# EAGLE design FRAM-DIP (EAGLE 9.6.2)
PC Engine Joypad Breakout Version 1.0
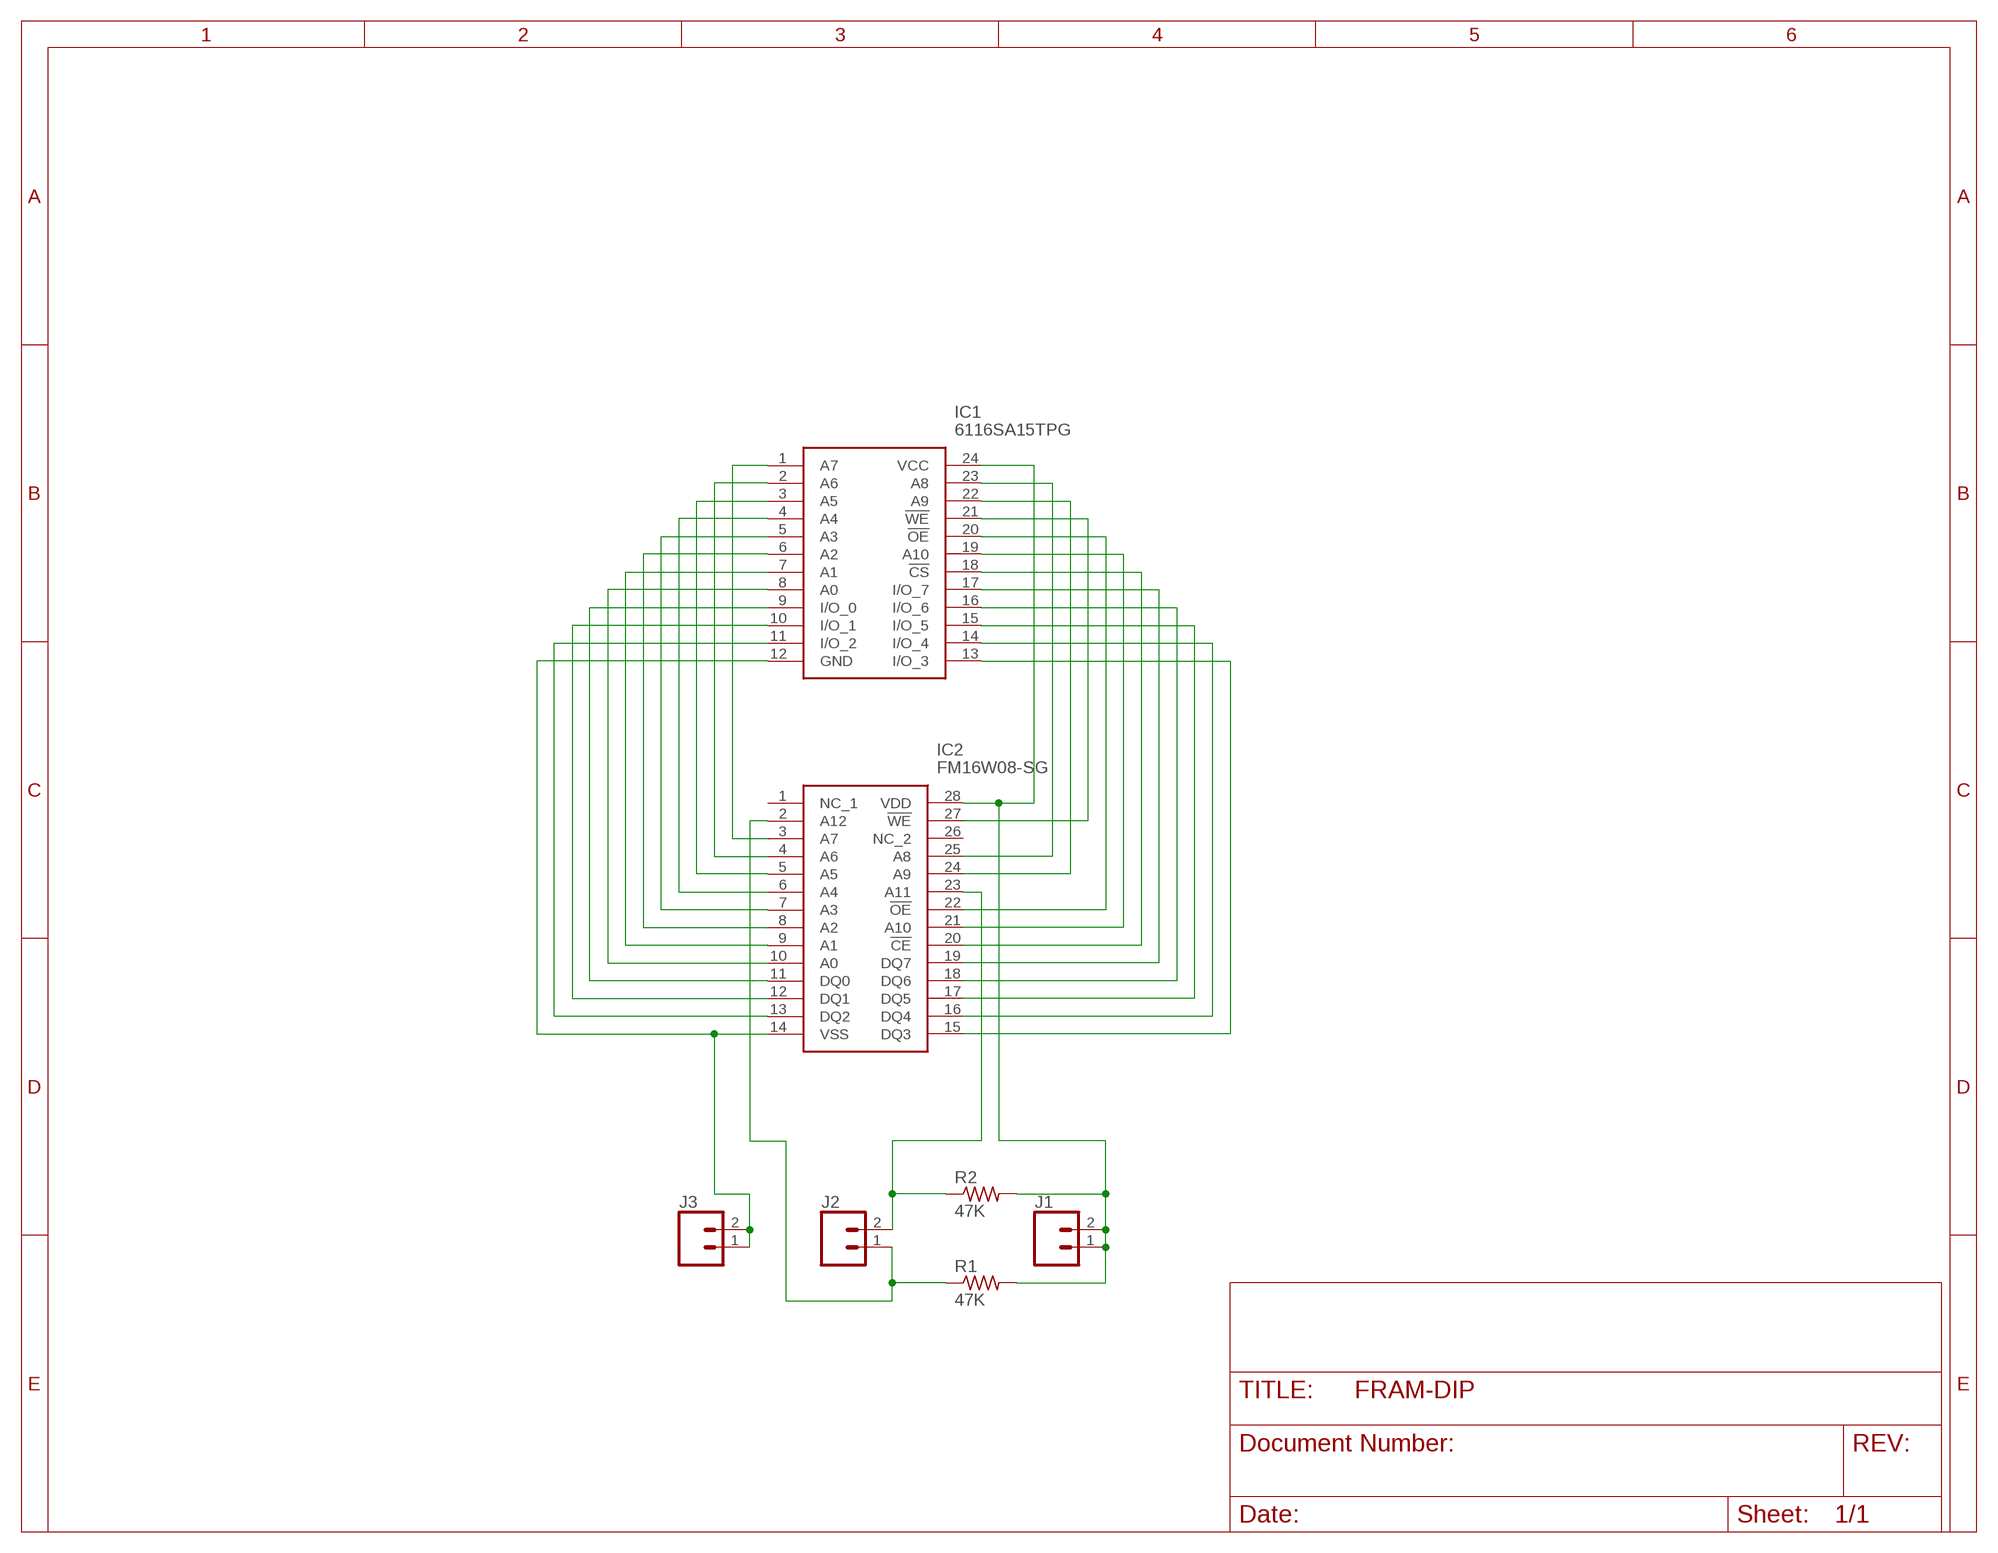
[diagram p0: schematic, sheet 1]

## Parts
IC1  6116SA15TPG  [DIP864W51P254L3169H381Q24N]
IC2  FM16W08-SG  [SOIC127P1032X267-28N]
J1  CONN_02  [1X02]
J2  CONN_02  [1X02]
J3  CONN_02  [1X02]
R1  47K  R-US_R0805  [R0805]
R2  47K  R-US_R0805  [R0805]

## Nets
N$1: IC1.24(VCC) IC2.28(VDD) J1.1 J1.2 R1.2 R2.2
N$2: IC1.23(A8) IC2.25(A8)
N$3: IC1.22(A9) IC2.24(A9)
N$4: IC1.21(!WE) IC2.27(!WE)
N$5: IC1.20(!OE) IC2.22(!OE)
N$6: IC1.19(A10) IC2.21(A10)
N$7: IC1.18(!CS) IC2.20(!CE)
N$8: IC1.17(I/O_7) IC2.19(DQ7)
N$9: IC1.16(I/O_6) IC2.18(DQ6)
N$10: IC1.15(I/O_5) IC2.17(DQ5)
N$11: IC1.14(I/O_4) IC2.16(DQ4)
N$12: IC1.13(I/O_3) IC2.15(DQ3)
N$13: IC1.1(A7) IC2.3(A7)
N$14: IC1.2(A6) IC2.4(A6)
N$15: IC1.3(A5) IC2.5(A5)
N$16: IC1.4(A4) IC2.6(A4)
N$17: IC1.5(A3) IC2.7(A3)
N$18: IC1.6(A2) IC2.8(A2)
N$19: IC1.7(A1) IC2.9(A1)
N$20: IC1.8(A0) IC2.10(A0)
N$21: IC1.9(I/O_0) IC2.11(DQ0)
N$22: IC1.10(I/O_1) IC2.12(DQ1)
N$23: IC1.11(I/O_2) IC2.13(DQ2)
N$25: IC2.2(A12) J2.1 R1.1
N$26: IC2.23(A11) J2.2 R2.1
N$28: IC1.12(GND) IC2.14(VSS) J3.1 J3.2
Unconnected: IC2.1(NC_1) IC2.26(NC_2)

## Library data of the parts
IC1 = PC-Engine:6116SA15TPG: PLASTIC DIP 300 MIL Source: Datasheet <https://www.idt.com/document/dst/6116sala-data-sheet>; ARROW_PART_NUMBER: 6116SA15TPG; DESCRIPTION: PLASTIC DIP 300 MIL; HEIGHT: 3.81mm; MANUFACTURER_NAME: IDT; MANUFACTURER_PART_NUMBER: 6116SA15TPG; MOUSER_PART_NUMBER: 972-6116SA15TPG; MOUSER_PRICE-STOCK: https://www.mouser.com/Search/Refine.aspx?Keyword=972-6116SA15TPG
IC2 = PC-Engine:FM16W08-SG: Cypress Semiconductor FM16W08-SG Parallel FRAM Memory, 64kbit, 70ns, 2.7 5.5 V SOIC 28-Pin Source: Datasheet <https://componentsearchengine.com/Datasheets/2/FM16W08-SG.pdf>; ARROW_PART_NUMBER: FM16W08-SG; ARROW_PRICE-STOCK: https://www.arrow.com/en/products/fm16w08-sg/cypress-semiconductor; DESCRIPTION: Cypress Semiconductor FM16W08-SG Parallel FRAM Memory, 64kbit, 70ns, 2.7 5.5 V SOIC 28-Pin; HEIGHT: 2.67mm; MANUFACTURER_NAME: Cypress Semiconductor; MANUFACTURER_PART_NUMBER: FM16W08-SG; MOUSER_PART_NUMBER: 877-FM16W08-SG; MOUSER_PRICE-STOCK: https://www.mouser.co.uk/ProductDetail/Cypress-Semiconductor/FM16W08-SG?qs=pA5MXup5wxHu1%2FuRaosnLA%3D%3D
J1-J3 = SparkFun-Connectors:CONN_02: Multi connection point. Often used as Generic Header-pin footprint for 0.1 inch spaced/style header connections On any of the 0.1 inch spaced packages, you can populate with these: Break Away Headers - Straight <https://www.sparkfun.com/products/116> (PRT-00116) Break Away Male Headers - Right Angle <https://www.sparkfun.com/products/553> (PRT-00553) Female Headers <https://www.sparkfun.com/products/115> (PRT-00115) Break Away Headers - Machine Pin <https://www.sparkfun.com/products/117> (PRT-00117) Break Away Female Headers - Swiss Machine Pin <https://www.sparkfun.com/products/743> (PRT-00743) For SCREWTERMINALS and SPRING TERMINALS visit here: Screw Terimnals on SparkFun.com <https://www.sparkfun.com/search/results?term=Screw+Terminals> (5mm/3.5mm/2.54mm spacing) This device is also useful as a general connection point to wire up your design to another part of your project. Our various solder wires solder well into these plated through hole pads. Hook-Up Wire - Assortment (Stranded, 22 AWG) <https://www.sparkfun.com/products/11375> (PRT-11375) Hook-Up Wire - Assortment (Solid Core, 22 AWG) <https://www.sparkfun.com/products/11367> (PRT-11367) View the entire wire category on our website here <https://www.sparkfun.com/categories/141> Special notes: Molex polarized connector foot print use with: PRT-08233 with associated crimp pins and housings. 2.54_SCREWTERM for use with PRT-10571. 3.5mm Screw Terminal footprints for PRT-08084 5mm Screw Terminal footprints for use with PRT-08432
R1 R2 = resistor:R-US_: RESISTOR, American symbol

## Net classes
0 default: width 0.203 mm, drill 0.356 mm, clearance 0.203 mm
1 breadboard: width 1.016 mm, drill 0.356 mm, clearance 0.305 mm
2 power: width 0.305 mm, drill 0.356 mm, clearance 0.305 mm
3 signal: width 0.203 mm, drill 0.356 mm, clearance 0.203 mm

## Board
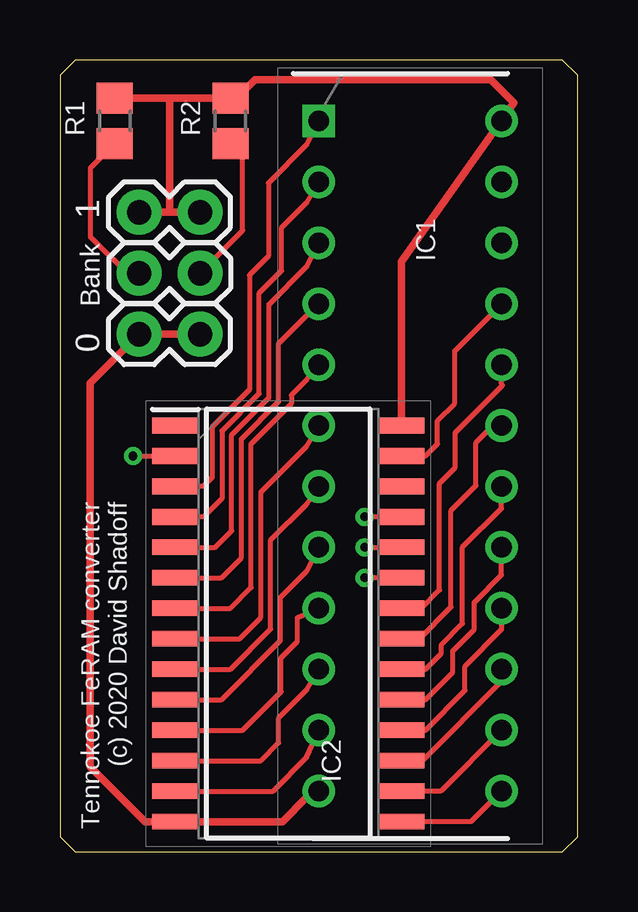
[diagram p1: board, top side]
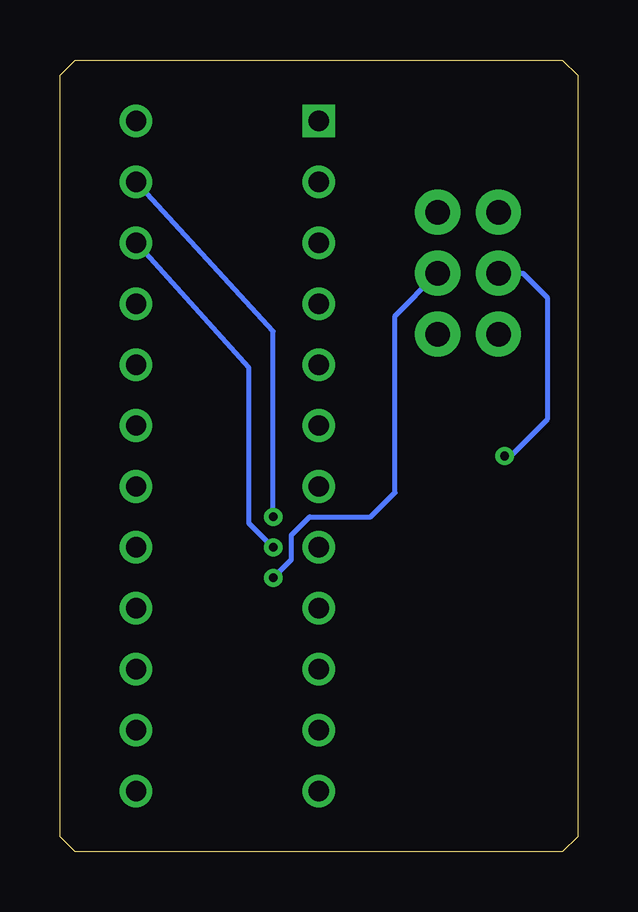
[diagram p2: board, bottom side, seen from below]

Size 21.59 x 33.02 mm. Coordinates in mm from the lower left corner, seen from the top.
Outline: 0,32.38 0,0.64 0.64,0 20.95,0 21.59,0.64 21.59,32.38 20.95,33.02 0.64,33.02 0,32.38
Copper layers (1*16): Top 0.035mm / dielectric 1.5mm / Bottom 0.035mm
Design rules "default *": minimum track width 6mil, minimum drill 0.35mm, track to track 6mil, track to pad 6mil, pad to pad 6mil, via to via 6mil, smd to smd 6mil, copper to edge 10mil, drill to drill 6mil, minimum pad ring 10mil, minimum via ring 8mil, stop-mask expansion 4mil, vias tented up to drill 15mil, thermal gap 10mil

### Footprints (pad centres in the part's own frame; a part is rotated, then mirrored left to right if it is on the bottom)
DIP864W51P254L3169H381Q24N = drill 0.85 pad 1.27 square: 1 -3.81,13.97 | drill 0.85 pad 1.27: 2 -3.81,11.43; 3 -3.81,8.89; 4 -3.81,6.35; 5 -3.81,3.81; 6 -3.81,1.27; 7 -3.81,-1.27; 8 -3.81,-3.81; 9 -3.81,-6.35; 10 -3.81,-8.89; 11 -3.81,-11.43; 12 -3.81,-13.97; 13 3.81,-13.97; 14 3.81,-11.43; 15 3.81,-8.89; 16 3.81,-6.35; 17 3.81,-3.81; 18 3.81,-1.27; 19 3.81,1.27; 20 3.81,3.81; 21 3.81,6.35; 22 3.81,8.89; 23 3.81,11.43; 24 3.81,13.97
SOIC127P1032X267-28N = smd 1.922 x 0.65: 1 -4.714,8.255; 2 -4.714,6.985; 3 -4.714,5.715; 4 -4.714,4.445; 5 -4.714,3.175; 6 -4.714,1.905; 7 -4.714,0.635; 8 -4.714,-0.635; 9 -4.714,-1.905; 10 -4.714,-3.175; 11 -4.714,-4.445; 12 -4.714,-5.715; 13 -4.714,-6.985; 14 -4.714,-8.255; 15 4.714,-8.255; 16 4.714,-6.985; 17 4.714,-5.715; 18 4.714,-4.445; 19 4.714,-3.175; 20 4.714,-1.905; 21 4.714,-0.635; 22 4.714,0.635; 23 4.714,1.905; 24 4.714,3.175; 25 4.714,4.445; 26 4.714,5.715; 27 4.714,6.985; 28 4.714,8.255
1X02 = drill 1.016 pad 1.88: 1 0,0; 2 2.54,0
R0805 = smd 1.3 x 1.5: 1 -0.95,0; 2 0.95,0

### Placement (x,y rotation side)
IC1  14.61,16.51 0 top
IC2  9.53,9.53 0 top
J1  5.84,26.67 180 top
J2  3.3,24.13 0 top
J3  5.84,21.59 180 top
R1  2.29,30.48 90 top
R2  7.11,30.48 90 top

### Tracks (layer width: path | path; a pad name or v marks a point on that pad's centre or on a via)
N$1
  Top 0.305: IC2.28 14.24,24.61 IC1.24 18.92,31.24 17.96,32.21 8.13,32.21 7.36,31.43 R2.2 4.57,31.43 | R1.2 4.57,31.43 | J1.1 4.57,26.67 | 4.57,26.67 J1.2 | 4.57,26.67 4.57,31.43
N$2  (via drill 0.36)
  Top 0.203: IC2.25 v12.7,13.97
  Bottom 0.203: v12.7,13.97 12.7,21.72 IC1.23
N$3  (via drill 0.36)
  Top 0.203: v12.7,12.7 IC2.24
  Bottom 0.203: IC1.22 13.72,20.19 13.72,13.72 v12.7,12.7
N$4
  Top 0.203: IC1.21 16.46,20.89 16.46,18.7 15.75,17.99 15.75,17.02 15.24,16.51 IC2.27
N$5
  Top 0.203: IC2.22 15.07,10.16 15.82,10.92 15.82,15.37 16.49,16.03 16.49,17.48 18.45,19.45 18.41,19.51 IC1.20
N$6
  Top 0.203: IC2.21 14.99,8.89 16.31,10.21 16.31,14.23 17.35,15.27 17.35,17.08 18.05,17.78 IC1.19
N$7
  Top 0.203: IC2.20 15.24,7.62 15.9,8.28 15.9,8.63 16.79,9.52 16.79,12.71 18.41,14.32 18.41,14.31 IC1.18
N$8
  Top 0.203: IC2.19 15.24,6.35 16.38,7.49 16.38,8.38 17.27,9.27 17.27,10.41 18.41,11.56 IC1.17
N$9
  Top 0.203: IC1.16 18.41,9.27 16.89,7.75 16.89,6.73 15.24,5.08 IC2.18
N$10
  Top 0.203: IC1.15 18.41,7.11 15.11,3.81 IC2.17
N$11
  Top 0.203: IC1.14 15.88,2.54 IC2.16
N$12
  Top 0.203: IC1.13 17.14,1.27 IC2.15
N$13
  Top 0.203: IC1.1 10.29,29.48 8.69,27.89 8.69,24.84 7.9,24.05 7.9,19.28 6.35,17.73 6.35,15.62 5.97,15.24 IC2.3
N$14
  Top 0.203: IC1.2 10.29,27.07 9.25,26.03 9.25,24.23 8.31,23.29 8.31,19.11 6.76,17.56 6.76,14.73 6,13.97 IC2.4
N$15
  Top 0.203: IC2.5 6.48,12.7 7.16,13.39 7.16,17.39 8.71,18.94 8.71,22.83 10.29,24.41 IC1.3
N$16
  Top 0.203: IC2.6 6.73,11.43 7.57,12.27 7.57,17.22 9.12,18.77 9.12,21.21 10.29,22.37 IC1.4
N$17
  Top 0.203: IC2.7 7.11,10.16 7.98,11.03 7.98,17.02 9.65,18.69 9.65,19.05 10.29,19.68 IC1.5
N$18
  Top 0.203: IC2.8 7.49,8.89 8.38,9.78 8.38,15.01 10.29,16.91 IC1.6
N$19
  Top 0.203: IC2.9 7.11,7.62 8.79,9.3 8.79,13 10.29,14.5 IC1.7
N$20
  Top 0.203: IC2.10 6.73,6.35 9.2,8.81 9.2,10.61 10.29,11.71 IC1.8
N$21
  Top 0.203: IC2.11 7.62,5.08 9.22,6.68 9.22,8.1 9.91,8.78 9.91,9.78 IC1.9
N$22
  Top 0.203: IC2.12 8.38,3.81 9.12,4.55 9.12,5.58 10.29,6.75 IC1.10
N$23
  Top 0.203: IC2.13 8.89,2.54 10.29,3.94 IC1.11
N$25  (via drill 0.36)
  Top 0.203: R1.1 1.27,28.51 1.27,25.65 2.79,24.13 J2.1 | v3.05,16.51 IC2.2
  Bottom 0.203: J2.1 2.29,24.13 1.27,23.11 1.27,18.03 2.79,16.51 v3.05,16.51
N$26  (via drill 0.36)
  Top 0.203: J2.2 7.62,25.91 7.62,29.02 R2.1 | IC2.23 v12.7,11.43
  Bottom 0.203: J2.2 7.62,22.35 7.62,14.99 8.64,13.97 11.18,13.97 11.94,13.21 11.94,12.19 v12.7,11.43
N$28
  Top 0.305: IC1.12 10.29,2.29 9.27,1.27 IC2.14 3.56,1.27 1.27,3.56 1.27,19.56 J3.2 J3.1

### Text on the board
tNames: 1 | Bank | 0 | Tennokoe FeRAM converter / (c) 2020 David Shadoff